# Altium schematic sheet MCU.SchDoc
size A4
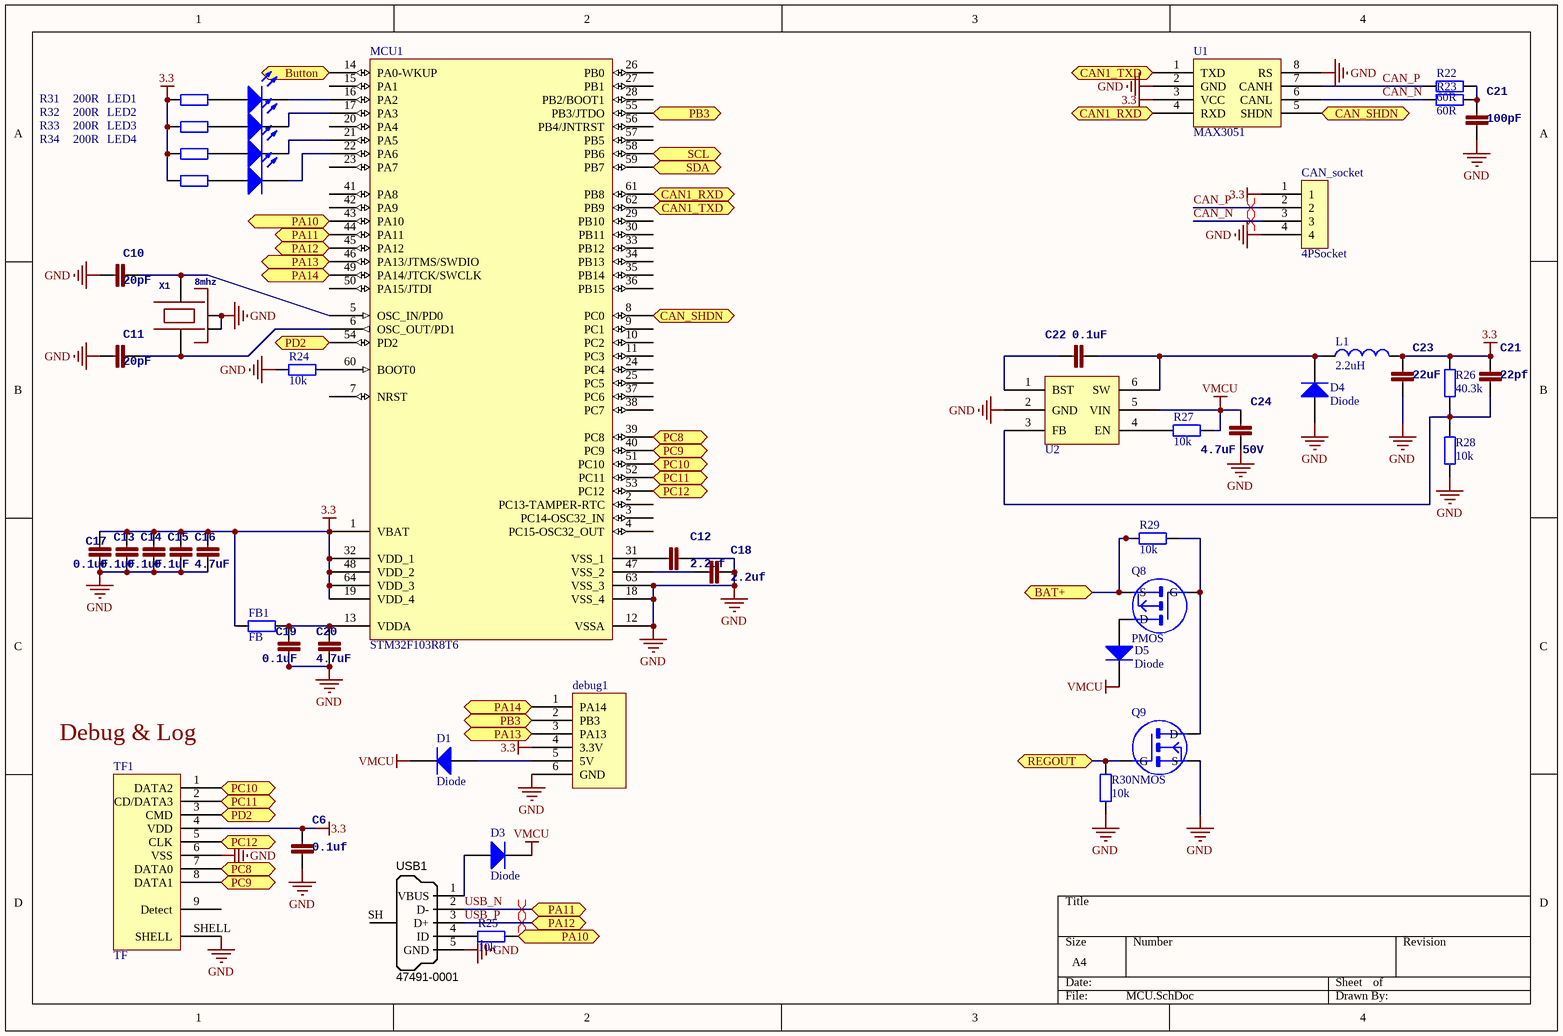
[diagram p0: MCU.SchDoc]

## Parts
(Parts that share a designator on the sheet are numbered #1, #2 ... from top to bottom, then left to right.)
C6  0.1uf  [0603]
C10  20pF  [0603]
C11  20pF  [0603]
C12  2.2uf  [0603]
C13  0.1uF  [0603]
C14  0.1uF  [0603]
C15  0.1uF  [0603]
C16  4.7uF  [0603]
C17  0.1uF  [0603]
C18  2.2uf  [0603]
C19  0.1uF  [0603]
C20  4.7uF  [0603]
C21#1  100pF  [0603]
C21#2  22pf  [0603]
C22  0.1uF  [0603]
C23  22uF  [0805]
C24  4.7uF 50V  [0805]
CAN_socket  4PSocket  [4pSocket-s]
D1  Diode  [0805]
D3  Diode  [0805]
D4  Diode  [0805]
D5  Diode  [0805]
debug1  debug  [WFRSM125]  (value not drawn)
FB1  FB  [0603]
L1  2.2uH  [1210]
LED1  LED0  [0603]  (value not drawn)
LED2  LED0  [0603]  (value not drawn)
LED3  LED0  [0603]  (value not drawn)
LED4  LED0  [0603]  (value not drawn)
MCU1  STM32F103R8T6  [LQFP64_N]
Q8  PMOS  [SOT-23B_L]
Q9  NMOS  [SOT-23B_L]
R22  60R  [0603]
R23  60R  [0603]
R24  10k  [0603]
R25  10k  [0603]
R26  40.3k  [0603]
R27  10k  [0603]
R28  10k  [0603]
R29  10k  [0603]
R30  10k  [0603]
R31  200R  [0603]
R32  200R  [0603]
R33  200R  [0603]
R34  200R  [0603]
TF1  TF  [TF]
U1  MAX3051  [SOT-8]
U2  MP2451  [SOT-23-6L]  (value not drawn)
USB1  Manufacturer Part Number 1: 47491-0001  [MOLEX-47346-0001]  (hidden comment: USB Micro Type B)
X1  8mhz  [OSCILLATOR-3.2X2.5]

## Ports
BAT+, Button, CAN1_RXD, CAN1_TXD, CAN_SHDN, PA10, PA11, PA12, PA13, PA14, PB3, PC8, PC9, PC10, PC11, PC12, PD2, REGOUT, SCL, SDA

## Nets
3.3: C6.2 C13.1 C14.1 C15.1 C16.2 C17.1 C21#2.2 C23.2 CAN_socket.1 debug1.4(3.3V) FB1.1 L1.2 MCU1.1(VBAT) MCU1.19(VDD_4) MCU1.32(VDD_1) MCU1.48(VDD_2) MCU1.64(VDD_3) R26.1 R31.1 R32.1 R33.1 R34.1 TF1.4(VDD) U1.3(VCC)
GND: C6.1 C10.2 C11.2 C12.2 C13.2 C14.2 C15.2 C16.1 C17.2 C18.2 C19.2 C20.1 C21#1.1 C23.1 C24.1 CAN_socket.4 D4.1(A) debug1.6(GND) MCU1.12(VSSA) MCU1.18(VSS_4) MCU1.63(VSS_3) Q9.S R24.2 R28.2 R30.1 TF1.6(VSS) TF1.SHELL U1.2(GND) U1.8(RS) U2.2(GND) USB1.5(GND) X1.2(NC_2) X1.4(NC_4)
VMCU: C24.2 D1.2(K) D3.2(K) D5.2(K) R27.2 U2.5(VIN)
BAT+: Q8.S R29.1 ; port BAT+
Button: MCU1.14(PA0-WKUP) ; port Button
CAN1_RXD: MCU1.61(PB8) U1.4(RXD) ; port CAN1_RXD
CAN1_TXD: MCU1.62(PB9) U1.1(TXD) ; port CAN1_TXD
CAN_N: CAN_socket.3 R23.2 U1.6(CANL)
CAN_P: CAN_socket.2 R22.2 U1.7(CANH)
CAN_SHDN: MCU1.8(PC0) U1.5(SHDN) ; port CAN_SHDN
PA10: MCU1.43(PA10) R25.1 ; port PA10
PA13: debug1.3(PA13) MCU1.46(PA13/JTMS/SWDIO) ; port PA13
PA14: debug1.1(PA14) MCU1.49(PA14/JTCK/SWCLK) ; port PA14
PB3: debug1.2(PB3) MCU1.55(PB3/JTDO) ; port PB3
PC8: MCU1.39(PC8) TF1.7(DATA0) ; port PC8
PC9: MCU1.40(PC9) TF1.8(DATA1) ; port PC9
PC10: MCU1.51(PC10) TF1.1(DATA2) ; port PC10
PC11: MCU1.52(PC11) TF1.2(CD/DATA3) ; port PC11
PC12: MCU1.53(PC12) TF1.5(CLK) ; port PC12
PD2: MCU1.54(PD2) TF1.3(CMD) ; port PD2
REGOUT: Q9.G R30.2 ; port REGOUT
SCL: MCU1.58(PB6) ; port SCL
SDA: MCU1.59(PB7) ; port SDA
USB_N: MCU1.44(PA11) USB1.2(D-) ; port PA11
USB_P: MCU1.45(PA12) USB1.3(D+) ; port PA12
NetC10_1: C10.1 MCU1.5(OSC_IN/PD0) X1.3
NetC11_1: C11.1 MCU1.6(OSC_OUT/PD1) X1.1
NetC12_1: C12.1 MCU1.31(VSS_1)
NetC18_1: C18.1 MCU1.47(VSS_2)
NetC19_1: C19.1 C20.2 FB1.2 MCU1.13(VDDA)
NetC21#1_2: C21#1.2 R22.1 R23.1
NetC21#2_1: C21#2.1 R26.2 R28.1 U2.3(FB)
NetC22_1: C22.1 D4.2(K) L1.1 U2.6(SW)
NetC22_2: C22.2 U2.1(BST)
NetD1_1: D1.1(A) debug1.5(5V)
NetD3_1: D3.1(A) USB1.1(VBUS)
NetD5_1: D5.1(A) Q8.D
NetLED1_1: LED1.1(A) R31.2
NetLED1_2: LED1.2(K) MCU1.16(PA2)
NetLED2_1: LED2.1(A) R32.2
NetLED2_2: LED2.2(K) MCU1.17(PA3)
NetLED3_1: LED3.1(A) R33.2
NetLED3_2: LED3.2(K) MCU1.21(PA5)
NetLED4_1: LED4.1(A) R34.2
NetLED4_2: LED4.2(K) MCU1.22(PA6)
NetMCU1_60: MCU1.60(BOOT0) R24.1
NetQ8_G: Q8.G Q9.D R29.2
NetR25_2: R25.2 USB1.4(ID)
NetR27_1: R27.1 U2.4(EN)

Not connected (* = marked no-connect by the designer): MCU1 2(PC13-TAMPER-RTC) 3(PC14-OSC32_IN) 4(PC15-OSC32_OUT) 7(NRST) 9(PC1) 10(PC2) 11(PC3) 15(PA1) 20(PA4) 23(PA7) 24(PC4) 25(PC5) 26(PB0) 27(PB1) 28(PB2/BOOT1) 29(PB10) 30(PB11) 33(PB12) 34(PB13) 35(PB14) 36(PB15) 37(PC6) 38(PC7) 41(PA8) 42(PA9) 50(PA15/JTDI) 56(PB4/JNTRST) 57(PB5); TF1 9(Detect); USB1 SH(Shell)

## Layout directives
differential pair: CAN_N, CAN_P, USB_N, USB_P

## Notes on the sheet
- (near TF1) Debug & Log

## Library data of the parts
C6 C10-C20 C21#1 C21#2 C22-C24 = CAP0402-CAP: 电容; PARTNO: CC0402ZRY5V7BB104
D1 D3-D5 = Diode: Default Diode; Published: 8-Jun-2000; LatestRevisionDate: 17-Jul-2002; LatestRevisionNote: Re-released for DXP Platform.; PackageVersion: Sep-1996; PackageReference: SMC; Publisher: Altium Limited; PackageDescription: DO-214-AB/SMC; 2 C-Bend Leads; Body 7.9 x 5.9 mm, inc. leads (LxW); Code_JEDEC: DO-214-AB
FB1 R22-R34 = Res2: 电阻; Value: 0Ohm; Published: 8-Jun-2000; LatestRevisionDate: 17-Jul-2002; LatestRevisionNote: Re-released for DXP Platform.; PackageReference: AXIAL-0.4; Publisher: Altium Limited; PackageDescription: Axial Device, Thru-Hole; 2 Leads; 0.4 in Pin Spacing
L1 = Inductor: Code_IEC: 1005; Value: 10mH; Published: 8-Jun-2000; LatestRevisionDate: 29-May-2009; LatestRevisionNote: IPC-7351 Footprint Added.; PackageReference: 0402-A; Publisher: Altium Limited; PackageDescription: Chip Inductor; Code_JEITA: 0402
LED1-LED4 = LED0: Typical INFRARED GaAs LED; Published: 8-Jun-2000; LatestRevisionDate: 08-Jul-2005; LatestRevisionNote: Mech Layer 1 removed.; PackageReference: LED-0; Publisher: Altium Limited; PackageDescription: LED; 2 Leads
MCU1 = STM32F103R8T6: STM32 ARM-based 32-bit MCU with 64 Kbytes Flash, 64-pin LQFP, Industrial Temperature; Published: *; DatasheetVersion: *; PackageVersion: *; PackageReference: *; Publisher: *; PackageDescription: *; ComponentLink1Description: *; ComponentLink1URL: *; ComponentLink2Description: *; ComponentLink2URL: *
Q8 = PMOS: pin to pad: D>3 G>1 S>2
Q9 = NMOS: pin to pad: D>3 G>1 S>2
USB1 = USB_Micro_TypeB: Connector SMD USB Micro Type B middle mount; Manufacturer 1: Molex Inc; SCDType: undef; Package / Case: SMD; Supplier 1: Digi-Key; Supplier Part Number 1: WM17142CT-ND
X1 = OSCILLATOR-3.2X2.5: Crystal Oscillator in 3.2x2.5 SMD